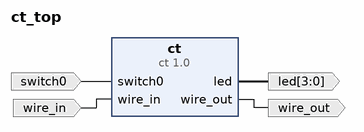
[diagram p0: block diagram of the top level]
# Vivado block design ct_top, xc7z010clg400-1, Vivado 2020.2
create_bd_design ct_top

create_bd_port -dir I switch0
create_bd_port -dir I wire_in
create_bd_port -dir O wire_out
create_bd_port -dir O -from 3 -to 0 led

create_bd_cell -type ip -vlnv www.telecom-paris.fr:DS:ct:1.0 ct

# ---- connections ----

connect_bd_net -net switch0_1 [get_bd_ports switch0] [get_bd_pins ct/switch0]
connect_bd_net [get_bd_ports wire_in] [get_bd_pins ct/wire_in]
connect_bd_net [get_bd_pins ct/wire_out] [get_bd_ports wire_out]
connect_bd_net [get_bd_pins ct/led] [get_bd_ports led]

validate_bd_design
save_bd_design
